# EAGLE design v2_front_panel (EAGLE 9.1.0)
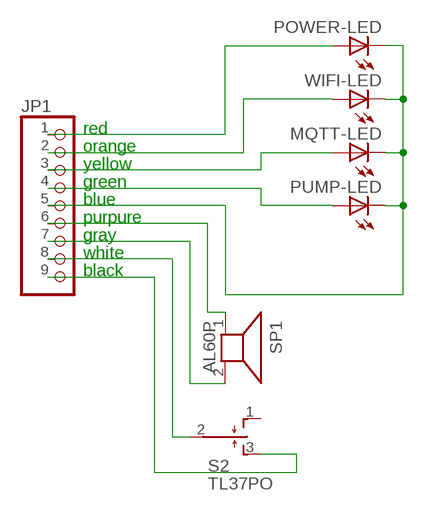
[diagram p0: schematic, sheet 1]

## Parts
JP1  PINHD-1X9  [1X09]
MQTT-LED  LED3MM  [LED3MM]
POWER-LED  LED3MM  [LED3MM]
PUMP-LED  LED3MM  [LED3MM]
S2  TL37PO  [TL3XPO]
SP1  AL60P  [AL60P]
WIFI-LED  LED3MM  [LED3MM]

## Nets
GND: JP1.5 MQTT-LED.K(C) POWER-LED.K(C) PUMP-LED.K(C) WIFI-LED.K(C)
N$1: JP1.6 SP1.1
N$2: JP1.7 SP1.2
N$3: JP1.1 POWER-LED.A
N$4: JP1.2 WIFI-LED.A
N$5: JP1.3 MQTT-LED.A
N$6: JP1.4 PUMP-LED.A
N$7: JP1.8 S2.2(P)
N$9: JP1.9 S2.3(S)
Unconnected: S2.1(O)

## Notes on the sheet
- red
- orange
- yellow
- green
- blue
- purpure
- gray
- white
- black

## Library data of the parts
JP1 = pinhead:PINHD-1X9: PIN HEADER
MQTT-LED POWER-LED PUMP-LED WIFI-LED = led:LED: LED OSRAM: - CHIPLED LG R971, LG N971, LY N971, LG Q971, LY Q971, LO R971, LY R971 LH N974, LH R974 LS Q976, LO Q976, LY Q976 LO Q996 - Hyper CHIPLED LW Q18S LB Q993, LB Q99A, LB R99A - SideLED LS A670, LO A670, LY A670, LG A670, LP A670 LB A673, LV A673, LT A673, LW A673 LH A674 LY A675 LS A676, LA A676, LO A676, LY A676, LW A676 LS A679, LY A679, LG A679 - Hyper Micro SIDELED® LS Y876, LA Y876, LO Y876, LY Y876 LT Y87S - SmartLED LW L88C, LW L88S LB L89C, LB L89S, LG L890 LS L89K, LO L89K, LY L89K LS L896, LA L896, LO L896, LY L896 - TOPLED LS T670, LO T670, LY T670, LG T670, LP T670 LSG T670, LSP T670, LSY T670, LOP T670, LYG T670 LG T671, LOG T671, LSG T671 LB T673, LV T673, LT T673, LW T673 LH T674 LS T676, LA T676, LO T676, LY T676, LB T676, LH T676, LSB T676, LW T676 LB T67C, LV T67C, LT T67C, LS T67K, LO T67K, LY T67K, LW E67C LS E67B, LA E67B, LO E67B, LY E67B, LB E67C, LV E67C, LT E67C LW T67C LS T679, LY T679, LG T679 LS T770, LO T770, LY T770, LG T770, LP T770 LB T773, LV T773, LT T773, LW T773 LH T774 LS E675, LA E675, LY E675, LS T675 LS T776, LA T776, LO T776, LY T776, LB T776 LHGB T686 LT T68C, LB T68C - Hyper Mini TOPLED® LB M676 - Mini TOPLED Santana® LG M470 LS M47K, LO M47K, LY M47K Source: http://www.osram.convergy.de LUXEON: - LUMILED® LXK2-PW12-R00, LXK2-PW12-S00, LXK2-PW14-U00, LXK2-PW14-V00 LXK2-PM12-R00, LXK2-PM12-S00, LXK2-PM14-U00 LXK2-PE12-Q00, LXK2-PE12-R00, LXK2-PE12-S00, LXK2-PE14-T00, LXK2-PE14-U00 LXK2-PB12-K00, LXK2-PB12-L00, LXK2-PB12-M00, LXK2-PB14-N00, LXK2-PB14-P00, LXK2-PB14-Q00 LXK2-PR12-L00, LXK2-PR12-M00, LXK2-PR14-Q00, LXK2-PR14-R00 LXK2-PD12-Q00, LXK2-PD12-R00, LXK2-PD12-S00 LXK2-PH12-R00, LXK2-PH12-S00 LXK2-PL12-P00, LXK2-PL12-Q00, LXK2-PL12-R00 Source: www.luxeon.com KINGBRIGHT: KA-3528ASYC Source: www.kingbright.com
S2 = switch:TL37PO: TINY SWITCH MOM OFF MOM Source: http://www2.produktinfo.conrad.com/datenblaetter/700000-724999/705152-da-01-de-Subminiaturschalter_TL_36YO.pdf
SP1 = buzzer:AL60P: SPEAKER Source: Buerklin; OC_FARNELL: unknown; OC_NEWARK: unknown

## Board
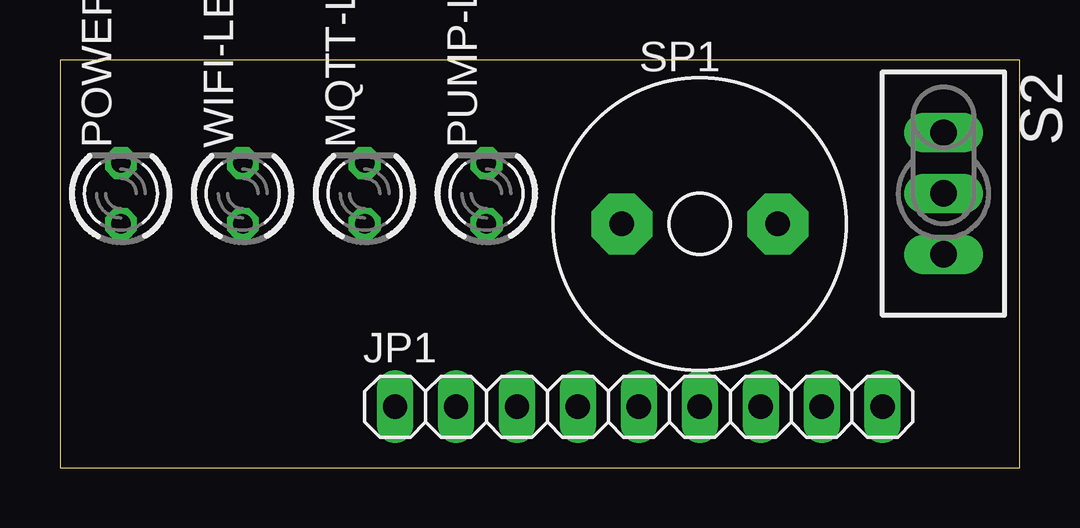
[diagram p1: board, top side]
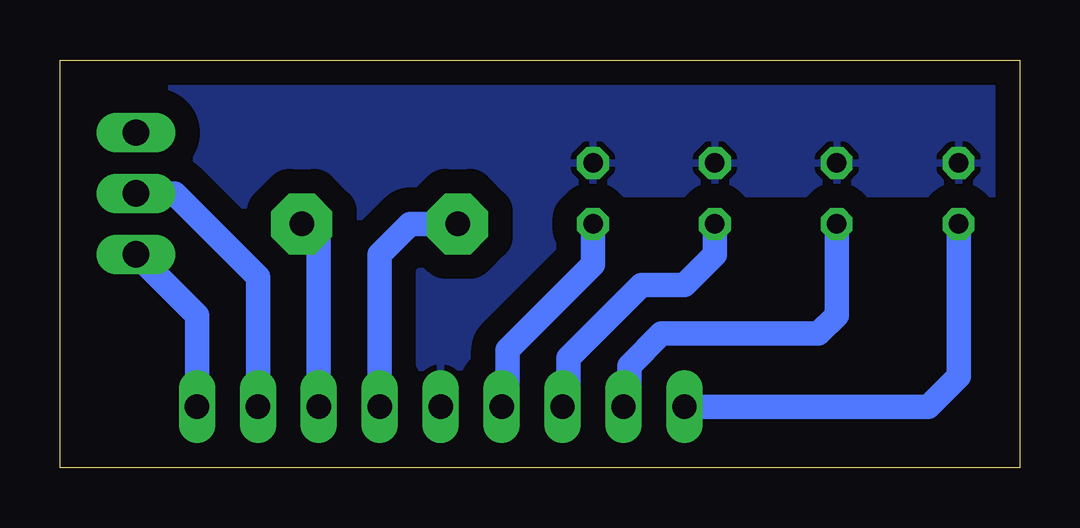
[diagram p2: board, bottom side, seen from below]

Size 40 x 17 mm. Coordinates in mm from the lower left corner, seen from the top.
Outline: 40,0 40,17 0,17 0,0 40,0
Copper layers (1*16): Top 0.035mm / dielectric 1.5mm / Bottom 0.035mm
Design rules "default *": minimum track width 6mil, minimum drill 0.35mm, track to track 40mil, track to pad 40mil, pad to pad 6mil, via to via 6mil, smd to smd 6mil, copper to edge 40mil, drill to drill 6mil, minimum pad ring 10mil, minimum via ring 8mil, stop-mask expansion 4mil, vias tented up to drill 0mil, thermal gap 10mil

### Footprints (pad centres in the part's own frame; a part is rotated, then mirrored left to right if it is on the bottom)
1X09 = drill 1.016 long: 1 -10.16,0; 2 -7.62,0; 3 -5.08,0; 4 -2.54,0; 5 0,0; 6 2.54,0; 7 5.08,0; 8 7.62,0; 9 10.16,0
LED3MM = drill 0.813 octagon: A -1.27,0; K 1.27,0
TL3XPO = drill 1.1 pad 1.422 long: 1 -2.54,0; 2 0,0; 3 2.54,0
AL60P = drill 1.016 pad 2.54 octagon: 1 -3.251,0; 2 3.251,0

### Placement (x,y rotation side)
JP1  24.13,2.54 0 top
MQTT-LED  12.7,11.43 90 top
POWER-LED  2.54,11.43 90 top
PUMP-LED  17.78,11.43 90 top
S2  36.83,11.43 270 top
SP1  26.67,10.16 0 top
WIFI-LED  7.62,11.43 90 top

### Tracks (layer width: path | path; a pad name or v marks a point on that pad's centre or on a via)
GND
  pour Bottom: 0,11.43 17.78,11.43 17.78,0 40.64,0 40.64,17.78 0,17.78
N$1
  Bottom 1.016: JP1.6 26.67,8.89 25.4,10.16 SP1.1
N$2
  Bottom 1.016: JP1.7 29.21,9.45 SP1.2
N$3
  Bottom 1.016: JP1.1 3.81,2.54 2.54,3.81 POWER-LED.A
N$4
  Bottom 1.016: JP1.2 16.26,2.79 16.26,4.25 14.92,5.59 8.38,5.59 7.62,6.35 WIFI-LED.A
N$5
  Bottom 1.016: MQTT-LED.A 12.7,8.89 13.97,7.62 15.76,7.62 18.8,4.58 18.8,2.79 JP1.3
N$6
  Bottom 1.016: JP1.4 21.34,2.79 21.34,4.92 17.78,8.47 PUMP-LED.A
N$7
  Bottom 1.016: JP1.8 31.75,7.96 35.22,11.43 S2.2
N$9
  Bottom 1.016: JP1.9 34.29,6.35 S2.3